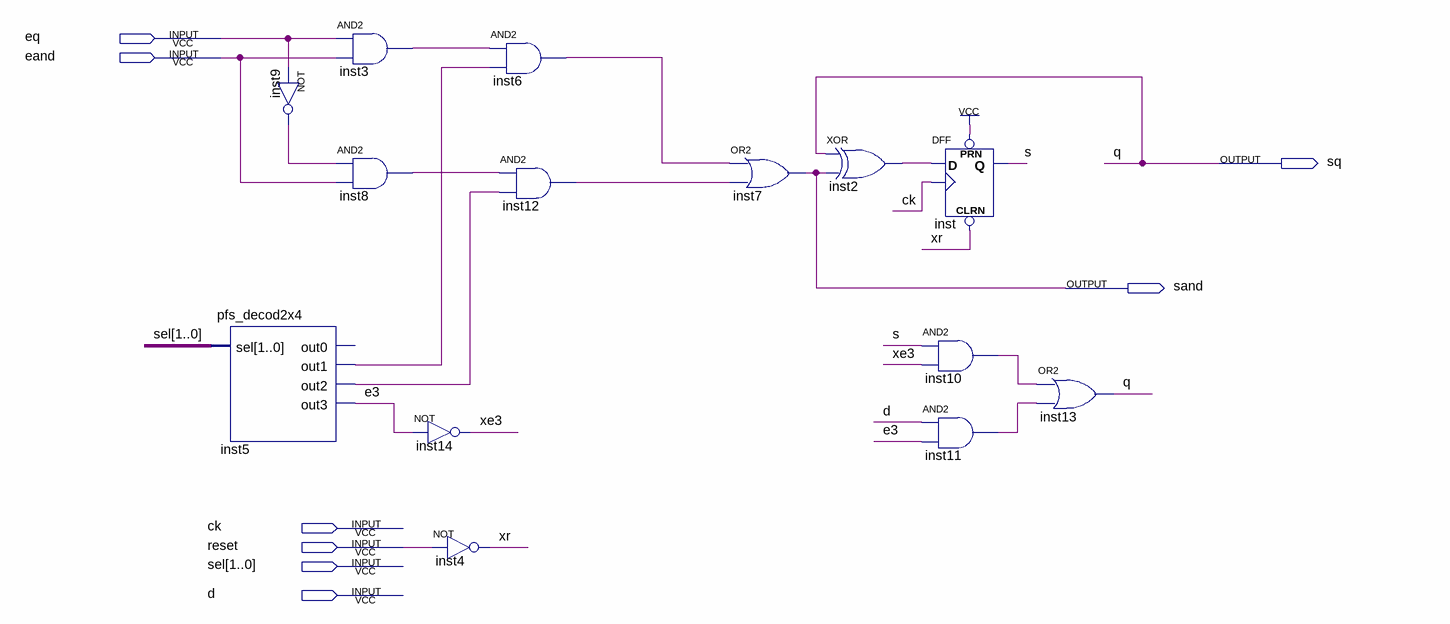
[diagram p0: schematic sheet]
// Quartus schematic pfs_uc_unit.bdf as structural Verilog: 14 symbols, 8 pins
module pfs_uc_unit (
  input  eq,
  input  eand,
  input  ck,
  input  reset,
  input  [1:0] sel,
  input  d,
  output sq,
  output sand
);

  wire e3, inst2_out, inst3_out, inst5_out1, inst5_out2, inst6_out, inst8_out, inst9_out, inst10_out,
       inst11_out, inst12_out, s, xe3, xr;

  pfs_decod2x4 inst5 (.sel(sel), .out1(inst5_out1), .out2(inst5_out2), .out3(e3));  // open: out0
  not inst9 (inst9_out, eq);
  and inst3 (inst3_out, eq, eand);
  and inst8 (inst8_out, inst9_out, eand);
  not inst14 (xe3, e3);
  not inst4 (xr, reset);
  and inst6 (inst6_out, inst3_out, inst5_out1);
  and inst12 (inst12_out, inst8_out, inst5_out2);
  or inst7 (sand, inst6_out, inst12_out);
  xor inst2 (inst2_out, sq, sand);
  DFF inst (.CLRN(xr), .CLK(ck), .D(inst2_out), .PRN(1'b1), .Q(s));
  and inst10 (inst10_out, s, xe3);
  and inst11 (inst11_out, d, e3);
  or inst13 (sq, inst10_out, inst11_out);

  // Other names for the same wires on the sheet: q = sq
endmodule
